# EasyEDA schematic Sch_Quick Dev R2.json
TITLE: Sheet_1; REV: 1.0; Date: 2021-03-13; Sheet: 1/1; Drawn By: Tim Neuber; Company: Your Company
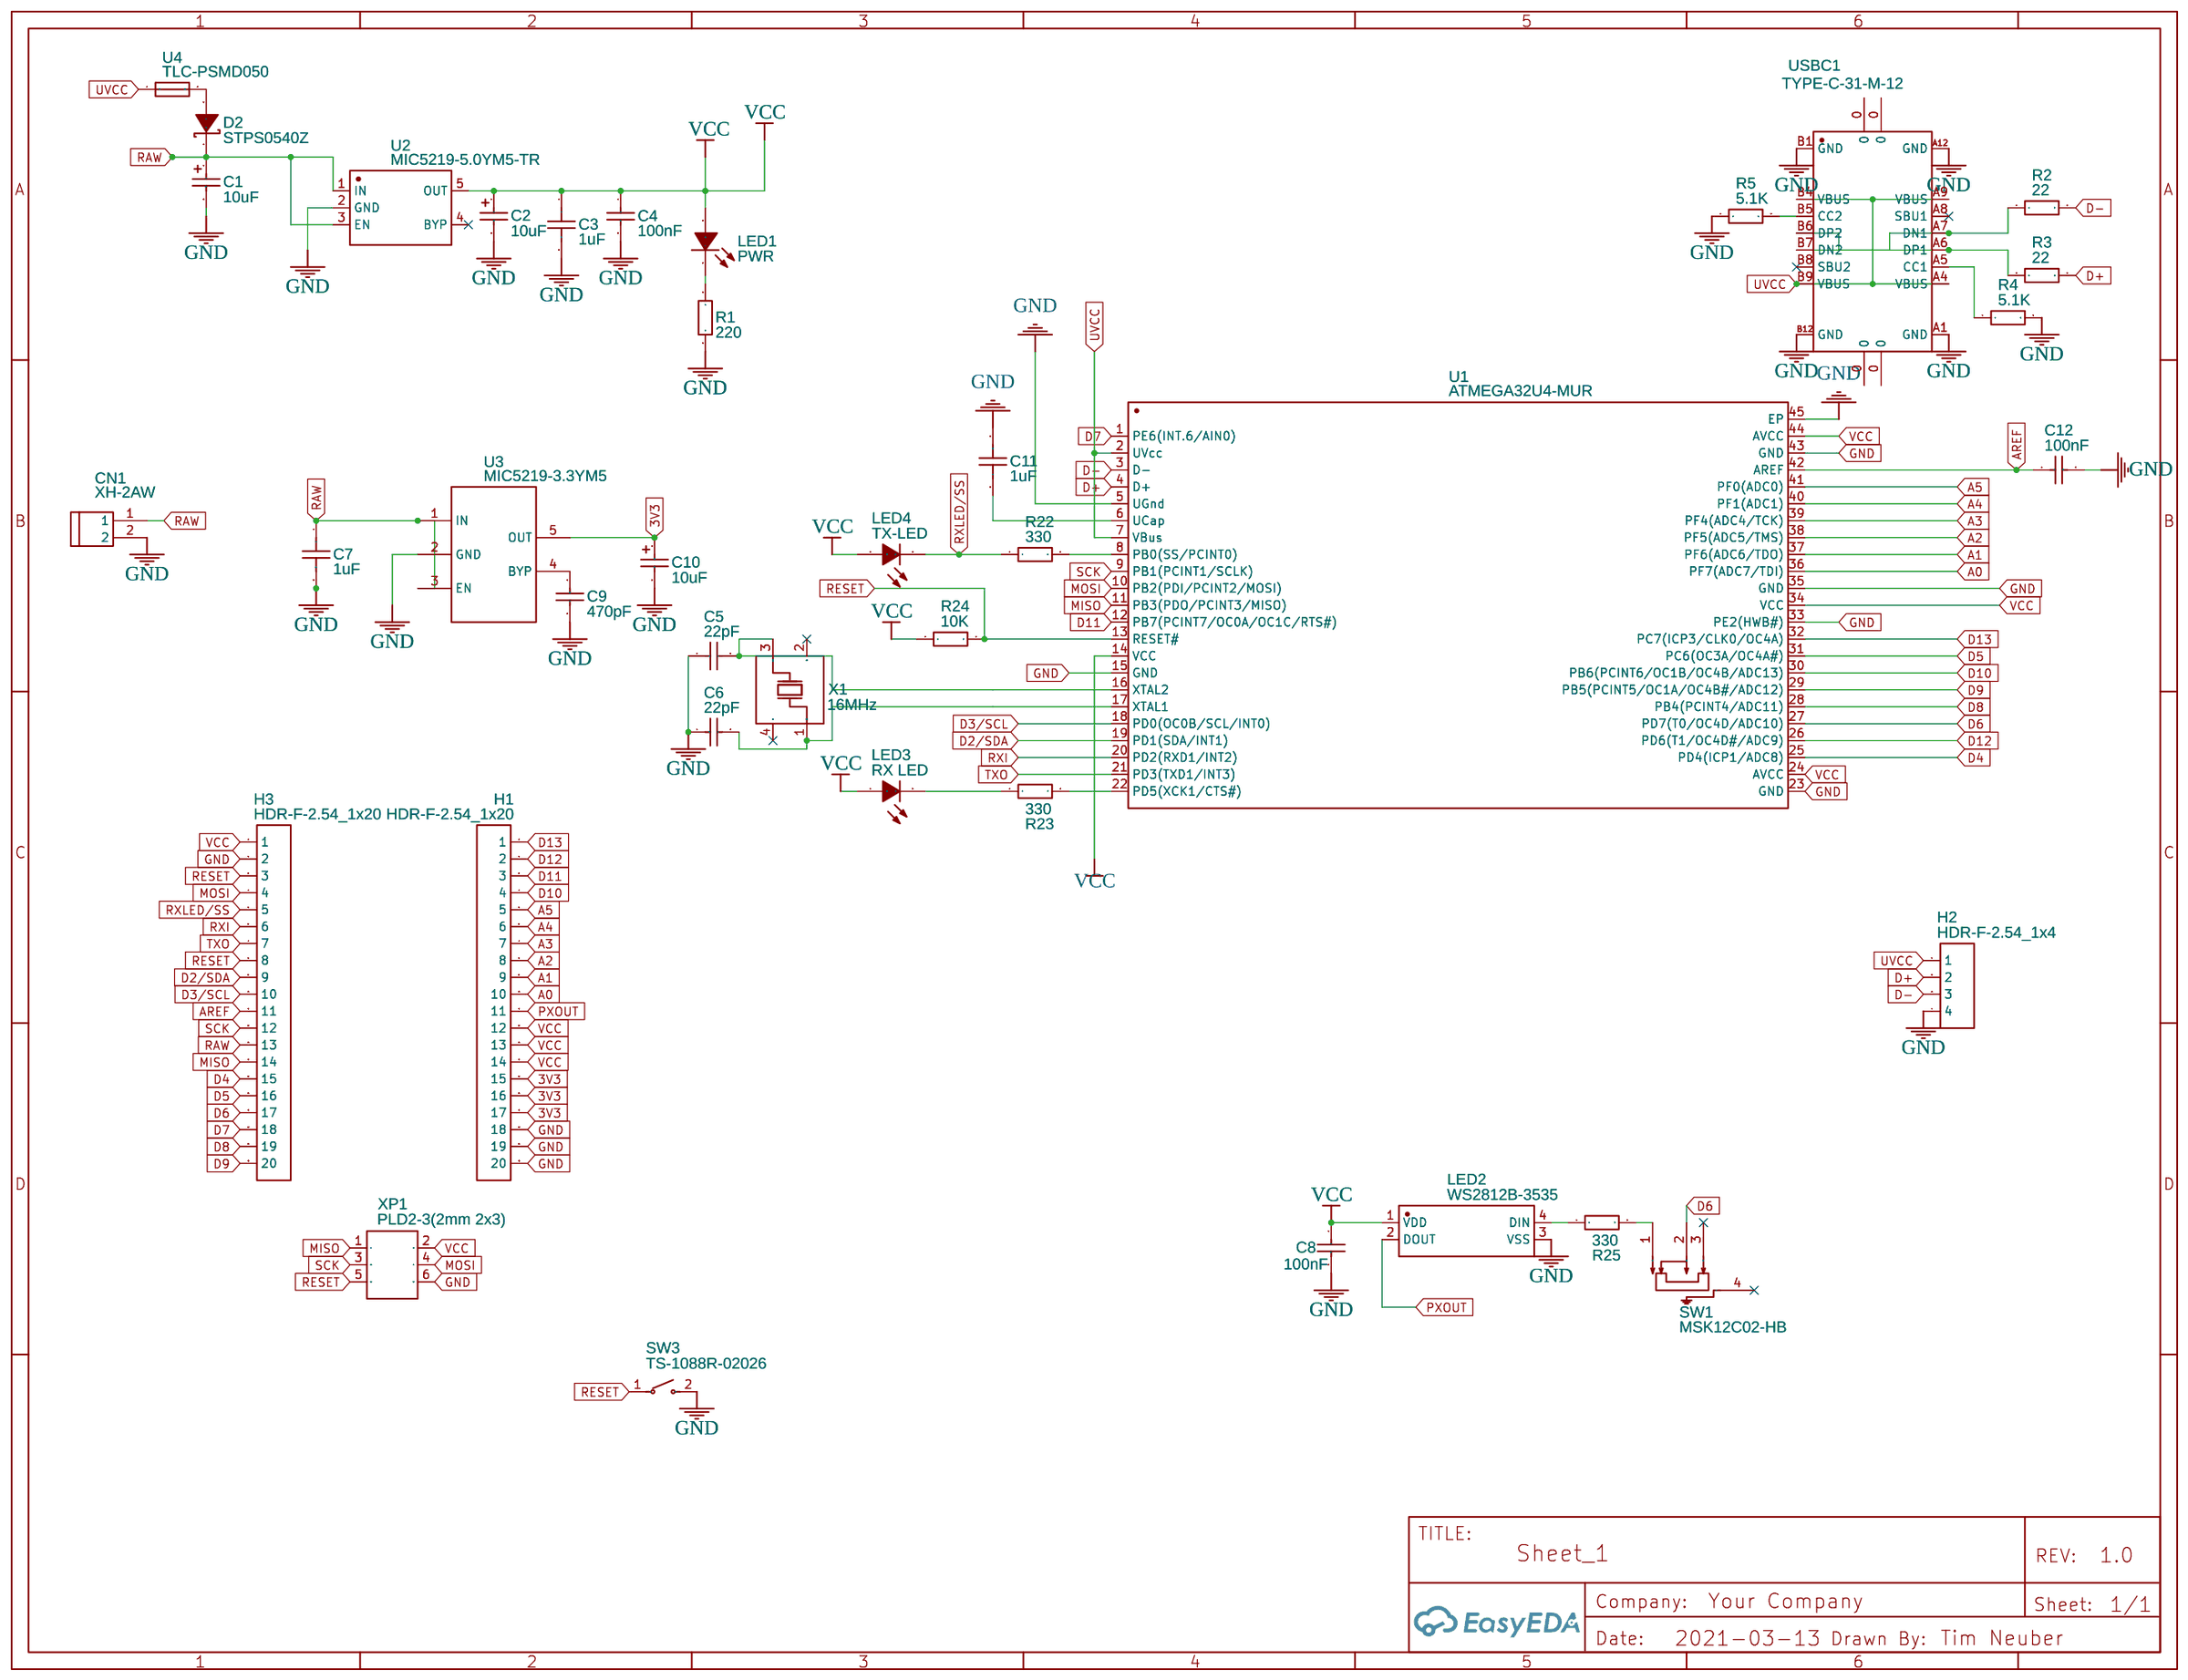
[diagram p0: schematic sheet]

## Parts
C1  10uF  [CAP-SMD_L3.2-W1.6-RD]
C2  10uF  [CAP-SMD_L3.2-W1.6-RD]
C3  1uF  [C0402]
C4  100nF  [C0402]
C5  22pF  [C0402]
C6  22pF  [C0402]
C7  1uF  [C0402]
C8  100nF  [C0402]
C9  470pF  [C0402]
C10  10uF  [CAP-SMD_L3.2-W1.6-RD]
C11  1uF  [C0402]
C12  100nF  [C0402]
CN1  XH-2AW  [CONN-TH_2P-P2.50_XH-2AW]
D2  STPS0540Z  [SOD-123_L2.8-W1.8-LS3.7-RD]
H1  HDR-F-2.54_1x20  [HDR-F-2.54_1X20]
H2  HDR-F-2.54_1x4  [HDR-F-2.54_1X4]
H3  HDR-F-2.54_1x20  [HDR-F-2.54_1X20]
LED1  PWR  [LED0603-R-RD]
LED2  WS2812B-3535  [LED-SMD_4P-L3.5-W3.5-TL_WS2812B]
LED3  RX LED  [LED0603-R-RD]
LED4  TX-LED  [LED0603-R-RD]
R1  220  [R0603]
R2  22  [R0402]
R3  22  [R0402]
R4  5.1K  [R0402]
R5  5.1K  [R0402]
R22  330  [R0402]
R23  330  [R0402]
R24  10K  [R0402]
R25  330  [R0402]
SW1  MSK12C02-HB  [SW-TH_MSK12C02-HB]
SW3  TS-1088R-02026  [SW-SMD_L3.9-W3.0-P4.45]
U1  ATMEGA32U4-MUR  [VQFN-44_L7.0-W7.0-P0.50-BL-EP5.2]
U2  MIC5219-5.0YM5-TR  [SOT-23-5_L3.0-W1.7-P0.95-LS2.8-TL]
U3  MIC5219-3.3YM5  [SOT-23-5_L3.0-W1.7-P0.95-LS2.8-TL]
U4  TLC-PSMD050  [R0805]
USBC1  TYPE-C-31-M-12  [USB-C_SMD-TYPE-C-31-M-12]
X1  16MHz  [OSC-SMD_4P-L3.2-W2.5-BL]
XP1  PLD2-3(2mm 2x3)  [PLD2-3]

## Library data of the parts
C1 C2 C10 = TAJA106K016RNJ: Supplier: LCSC; Manufacturer: AVX; Supplier Part: C7171; SMT Type: Basic; JLCPCB SMD: Yes; Assembly Type: smtWeld; Paste Type: base
C3 C7 C11 = CL05A105KA5NQNC: Supplier: LCSC; Manufacturer: SAMSUNG; Supplier Part: C52923; SMT Type: Basic; JLCPCB SMD: Yes; LCSC Assembly: Yes; Assembly Type: smtWeld; Paste Type: base
C4 C8 C12 = CL05B104KO5NNNC: Supplier: LCSC; Manufacturer: SAMSUNG; Supplier Part: C1525; SMT Type: Basic; JLCPCB SMD: Yes; LCSC Assembly: Yes; Assembly Type: smtWeld; Paste Type: base
C5 C6 = 0402CG220J500NT: Supplier: LCSC; Manufacturer: FH; Supplier Part: C1555; SMT Type: Basic; JLCPCB SMD: Yes; LCSC Assembly: Yes; Assembly Type: smtWeld; Paste Type: base
C9 = 0402B471K500NT: Supplier: LCSC; Manufacturer: FH; Supplier Part: C1537; SMT Type: Basic; JLCPCB SMD: Yes; LCSC Assembly: Yes; Paste Type: base
CN1 = XH-2AW: Supplier: LCSC; Manufacturer: BOOMELE; image: //image.lceda.cn/szlcsc/C33132.jpg; Supplier Part: C33132; LCSC Assembly: Yes; SMT Type: Extend; Paste Type: expand
D2 = STPS0540Z: Supplier: LCSC; Manufacturer: STMicroelectronics; Contributor: LCSC; Supplier Part: C181835; SMT Type: Extend; JLCPCB SMD: Yes; LCSC Assembly: Yes; Paste Type: expand
H1 H3 = HDR-F-2.54_1x20: Supplier Part: C50984; Supplier: LCSC; Contributor: LCEDA_Lib
H2 = HDR-F-2.54_1x4: Supplier Part: C225501; Supplier: LCSC; Contributor: LCEDA_Lib
LED1 = KT-0603R: Supplier: LCSC; Manufacturer: KENTO; image: //image.lceda.cn/szlcsc/C2286.jpg; Supplier Part: C2286; SMT Type: Basic; JLCPCB SMD: Yes; LCSC Assembly: Yes; Assembly Type: smtWeld; Paste Type: base
LED2 = WS2812B-3535: Supplier: LCSC; Manufacturer: Worldsemi; Contributor: LCSC; Supplier Part: C114583; SMT Type: Extend; JLCPCB SMD: Yes; Assembly Type: smtWeld; Paste Type: recommend
LED3 LED4 = 19-217/BHC-ZL1M2RY/3T: Supplier: LCSC; Manufacturer: EVERLIGHT; image: //image.lceda.cn/szlcsc/C72041.jpg; Supplier Part: C72041; JLCPCB Part Class: Basic Part
R1 = 0603WAF2200T5E: Supplier: LCSC; Manufacturer: UniOhm; Supplier Part: C22962; SMT Type: Basic; JLCPCB SMD: Yes; LCSC Assembly: Yes; Assembly Type: smtWeld; Paste Type: base
R2 R3 = 0402WGF220JTCE: Supplier: LCSC; Manufacturer: UniOhm; Supplier Part: C25092; SMT Type: Basic; JLCPCB SMD: Yes; LCSC Assembly: Yes; Paste Type: base
R4 R5 = 0402WGF5101TCE: Supplier: LCSC; Manufacturer: UniOhm; Supplier Part: C25905; SMT Type: Basic; JLCPCB SMD: Yes; LCSC Assembly: Yes; Paste Type: base
R22 R23 R25 = 0402WGF3300TCE: Supplier: LCSC; Manufacturer: UniOhm; Supplier Part: C25104; SMT Type: Basic; JLCPCB SMD: Yes; LCSC Assembly: Yes; Paste Type: base
R24 = 0402WGF1002TCE: Supplier: LCSC; Manufacturer: UniOhm; Supplier Part: C25744; SMT Type: Basic; JLCPCB SMD: Yes; LCSC Assembly: Yes; Paste Type: base
SW1 = MSK12C02-HB: Supplier: LCSC; Supplier Part: C431541; Manufacturer: SHOU HAN; Contributor: LCSC; JLCPCB Part Class: Extended Part
SW3 = TS-1088R-02026: Supplier: LCSC; Supplier Part: C455280; Manufacturer: XUNPU; Contributor: LCSC; LCSC Assembly: Yes; SMT Type: Extend; Paste Type: expand
U1 = ATMEGA32U4-MUR: Contributor: KiCad; Supplier: LCSC; Manufacturer: MICROCHIP; Supplier Part: C45874; SMT Type: Extend; JLCPCB SMD: Yes; Assembly Type: smtWeld; Paste Type: recommend
U2 = MIC5219-5.0YM5-TR: Supplier: LCSC; Manufacturer: MICROCHIP; Contributor: LCSC; Supplier Part: C144182; SMT Type: Extend; JLCPCB SMD: Yes; LCSC Assembly: Yes; Assembly Type: smtWeld; Paste Type: expand
U3 = MIC5219-3.3YM5: Supplier: LCSC; Manufacturer: MICROCHIP; image: //image.lceda.cn/szlcsc/C29613.jpg; Supplier Part: C29613; SMT Type: Extend; JLCPCB SMD: Yes; Paste Type: recommend
U4 = TLC-PSMD050: Supplier: LCSC; Supplier Part: C261942; Manufacturer: TLC Electronic; Contributor: LCSC; SMT Type: Extend; JLCPCB SMD: Yes; Paste Type: recommend
USBC1 = TYPE-C-31-M-12: Supplier: LCSC; Supplier Part: C165948; Manufacturer: Rectangular Connectors - Contacts; Contributor: LCSC; Assembly Type: smtWeld; Paste Type: expand
X1 = X322516MLB4SI: Supplier: LCSC; Manufacturer: YXC; Supplier Part: C13738; SMT Type: Basic; JLCPCB SMD: Yes; LCSC Assembly: Yes; Assembly Type: smtWeld; Paste Type: base
XP1 = PLD2-3(2mm 2x3): Manufacturer Part: PLD-3 2,54 2x3; Contributor: popov_a_r

## Nets
3V3: C10.1 H1.15 H1.16 H1.17 U3.5(OUT)
GND: C1.2 C2.2 C3.2 C4.2 C5.1 C6.1 C7.2 C8.2 C9.1 C10.2 C11.1 C12.2 CN1.2 H1.18 H1.19 H1.20 H2.4 H3.2 LED2.3(VSS) R1.1 R4.2 R5.1 SW3.2 U1.5(UGnd) U1.15(GND) U1.23(GND) U1.33(PE2(HWB#)) U1.35(GND) U1.43(GND) U1.45(EP) U2.2(GND) U3.2(GND) USBC1.A1(GND) USBC1.A12(GND) USBC1.B1(GND) USBC1.B12(GND) XP1.6
VCC: C2.1 C3.1 C4.1 C8.1 H1.12 H1.13 H1.14 H3.1 LED1.1(A) LED2.1(VDD) LED3.1(A) LED4.1(A) R24.1 U1.14(VCC) U1.24(AVCC) U1.34(VCC) U1.44(AVCC) U2.5(OUT) XP1.2
A0: H1.10 U1.36(PF7(ADC7/TDI))
A1: H1.9 U1.37(PF6(ADC6/TDO))
A2: H1.8 U1.38(PF5(ADC5/TMS))
A3: H1.7 U1.39(PF4(ADC4/TCK))
A4: H1.6 U1.40(PF1(ADC1))
A5: H1.5 U1.41(PF0(ADC0))
AREF: C12.1 H3.11 U1.42(AREF)
D2/SDA: H3.9 U1.19(PD1(SDA/INT1))
D3/SCL: H3.10 U1.18(PD0(OC0B/SCL/INT0))
D4: H3.15 U1.25(PD4(ICP1/ADC8))
D5: H3.16 U1.31(PC6(OC3A/OC4A#))
D6: H3.17 SW1.2 U1.27(PD7(T0/OC4D/ADC10))
D7: H3.18 U1.1(PE6(INT.6/AIN0))
D8: H3.19 U1.28(PB4(PCINT4/ADC11))
D9: H3.20 U1.29(PB5(PCINT5/OC1A/OC4B#/ADC12))
D10: H1.4 U1.30(PB6(PCINT6/OC1B/OC4B/ADC13))
D11: H1.3 U1.12(PB7(PCINT7/OC0A/OC1C/RTS#))
D12: H1.2 U1.26(PD6(T1/OC4D#/ADC9))
D13: H1.1 U1.32(PC7(ICP3/CLK0/OC4A))
D+: H2.2 R3.2 U1.4(D+)
D-: H2.3 R2.2 U1.3(D-)
MISO: H3.14 U1.11(PB3(PDO/PCINT3/MISO)) XP1.1
MOSI: H3.4 U1.10(PB2(PDI/PCINT2/MOSI)) XP1.4
PXOUT: H1.11 LED2.2(DOUT)
RAW: C1.1 C7.1 CN1.1 D2.1(K) H3.13 U2.1(IN) U2.3(EN) U3.1(IN) U3.3(EN)
RESET: H3.3 H3.8 R24.2 SW3.1 U1.13(RESET#) XP1.5
RXI: H3.6 U1.20(PD2(RXD1/INT2))
RXLED/SS: H3.5 LED4.2(C) R22.1
SCK: H3.12 U1.9(PB1(PCINT1/SCLK)) XP1.3
TXO: H3.7 U1.21(PD3(TXD1/INT3))
UVCC: H2.1 U1.2(UVcc) U1.7(VBus) U4.1 USBC1.A4(VBUS) USBC1.A9(VBUS) USBC1.B4(VBUS) USBC1.B9(VBUS)
Net-(C5-2): C5.2 U1.16(XTAL2) X1.3(OSC2)
Net-(C6-2): C6.2 U1.17(XTAL1) X1.1(OSC1)
Net-(C9-2): C9.2 U3.4(BYP)
Net-(C11-2): C11.2 U1.6(UCap)
Net-(D2-2): D2.2(A) U4.2
Net-(LED1-2): LED1.2(K) R1.2
Net-(LED2-4): LED2.4(DIN) R25.1
Net-(LED3-2): LED3.2(C) R23.1
Net-(R2-1): R2.1 USBC1.A7(DN1) USBC1.B7(DN2)
Net-(R3-1): R3.1 USBC1.A6(DP1) USBC1.B6(DP2)
Net-(R4-1): R4.1 USBC1.A5(CC1)
Net-(R5-2): R5.2 USBC1.B5(CC2)
Net-(R22-2): R22.2 U1.8(PB0(SS/PCINT0))
Net-(R23-2): R23.2 U1.22(PD5(XCK1/CTS#))
Net-(R25-2): R25.2 SW1.1

Not connected (* = marked no-connect by the designer): SW1 3* 4*; U2 4(BYP)*; USBC1 0 A8(SBU1)* B8(SBU2)*; X1 2(GND)* 4(GND)*
